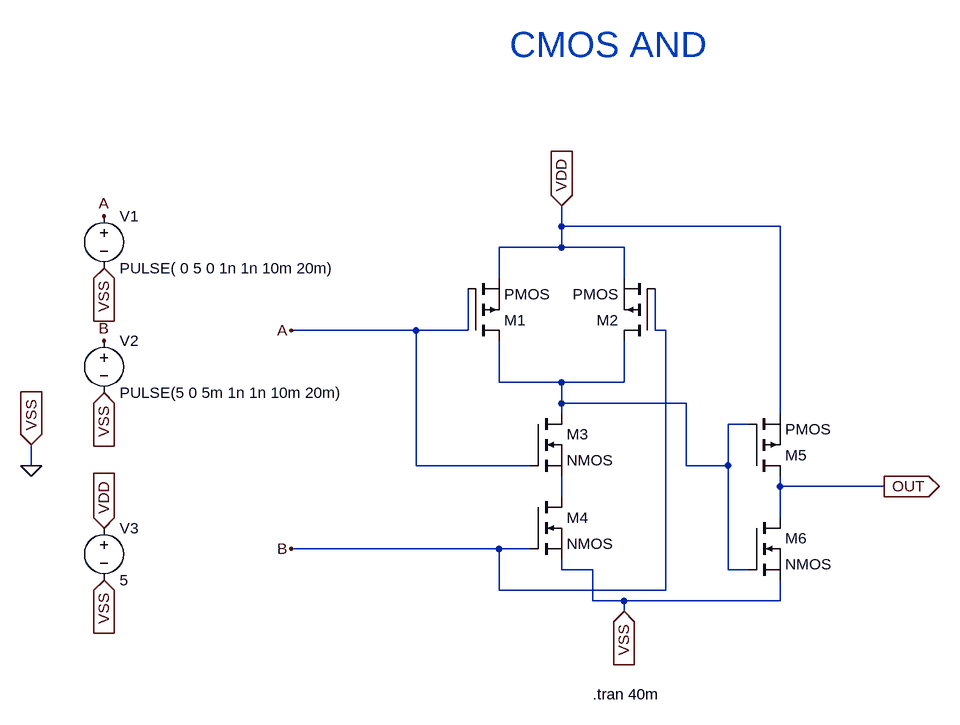
[diagram p0: schematic CMOS AND.asc]
CMOS AND.asc, the LTspice schematic file:
Version 4.1
SHEET 1 880 680
WIRE 128 -112 128 -144
WIRE 464 -112 128 -112
WIRE 128 -80 128 -112
WIRE 128 -80 32 -80
WIRE 224 -80 128 -80
WIRE 32 -32 32 -80
WIRE 224 -32 224 -80
WIRE -96 48 -288 48
WIRE -16 48 -16 -16
WIRE -16 48 -96 48
WIRE 272 48 272 -16
WIRE 288 48 272 48
WIRE 32 128 32 64
WIRE 128 128 32 128
WIRE 224 128 224 64
WIRE 224 128 128 128
WIRE 128 160 128 128
WIRE 320 160 128 160
WIRE 128 176 128 160
WIRE 464 176 464 -112
WIRE 416 192 384 192
WIRE -688 256 -688 224
WIRE -96 256 -96 48
WIRE 80 256 -96 256
WIRE 320 256 320 160
WIRE 384 256 384 192
WIRE 384 256 320 256
WIRE 464 288 464 272
WIRE 624 288 464 288
WIRE 128 304 128 272
WIRE 464 336 464 288
WIRE 32 384 -288 384
WIRE 80 384 32 384
WIRE 128 416 128 400
WIRE 176 416 128 416
WIRE 384 416 384 256
WIRE 416 416 384 416
WIRE 32 448 32 384
WIRE 288 448 288 48
WIRE 288 448 32 448
WIRE 176 464 176 416
WIRE 224 464 176 464
WIRE 464 464 464 432
WIRE 464 464 224 464
WIRE 224 480 224 464
FLAG -288 48 A
FLAG 624 288 OUT
IOPIN 624 288 Out
FLAG -288 384 B
FLAG 128 -144 VDD
IOPIN 128 -144 In
FLAG 224 480 VSS
IOPIN 224 480 In
FLAG -688 256 0
FLAG -576 144 VSS
IOPIN -576 144 In
FLAG -576 -48 VSS
IOPIN -576 -48 In
FLAG -576 432 VSS
IOPIN -576 432 In
FLAG -688 224 VSS
IOPIN -688 224 In
FLAG -576 64 B
FLAG -576 -128 A
FLAG -576 352 VDD
IOPIN -576 352 In
SYMBOL pmos -16 64 M180
SYMATTR InstName M1
SYMBOL pmos 272 64 R180
SYMATTR InstName M2
SYMBOL nmos 80 176 R0
SYMATTR InstName M3
SYMBOL nmos 80 304 R0
SYMATTR InstName M4
SYMBOL pmos 416 272 M180
SYMATTR InstName M5
SYMBOL nmos 416 336 R0
SYMATTR InstName M6
SYMBOL voltage -576 -144 R0
SYMATTR InstName V1
SYMATTR Value PULSE( 0 5 0 1n 1n 10m 20m)
SYMBOL voltage -576 48 R0
WINDOW 123 0 0 Left 0
WINDOW 39 0 0 Left 0
SYMATTR InstName V2
SYMATTR Value PULSE(5 0 5m 1n 1n 10m 20m)
SYMBOL voltage -576 336 R0
SYMATTR InstName V3
SYMATTR Value 5
TEXT 176 608 Left 2 !.tran 40m
TEXT 48 -392 Left 5 ;CMOS AND

The netlist it stands for:
* CMOS AND.asc
M1 N001 A VDD VDD PMOS
M2 N001 B VDD VDD PMOS
M3 N001 A N002 N002 NMOS
M4 N002 B 0 0 NMOS
M5 OUT N001 VDD VDD PMOS
M6 OUT N001 0 0 NMOS
V1 A 0 PULSE( 0 5 0 1n 1n 10m 20m)
V2 B 0 PULSE(5 0 5m 1n 1n 10m 20m)
V3 VDD 0 5
.model NMOS NMOS
.model PMOS PMOS
.lib standard.mos
.tran 40m
* CMOS AND
.backanno
.end